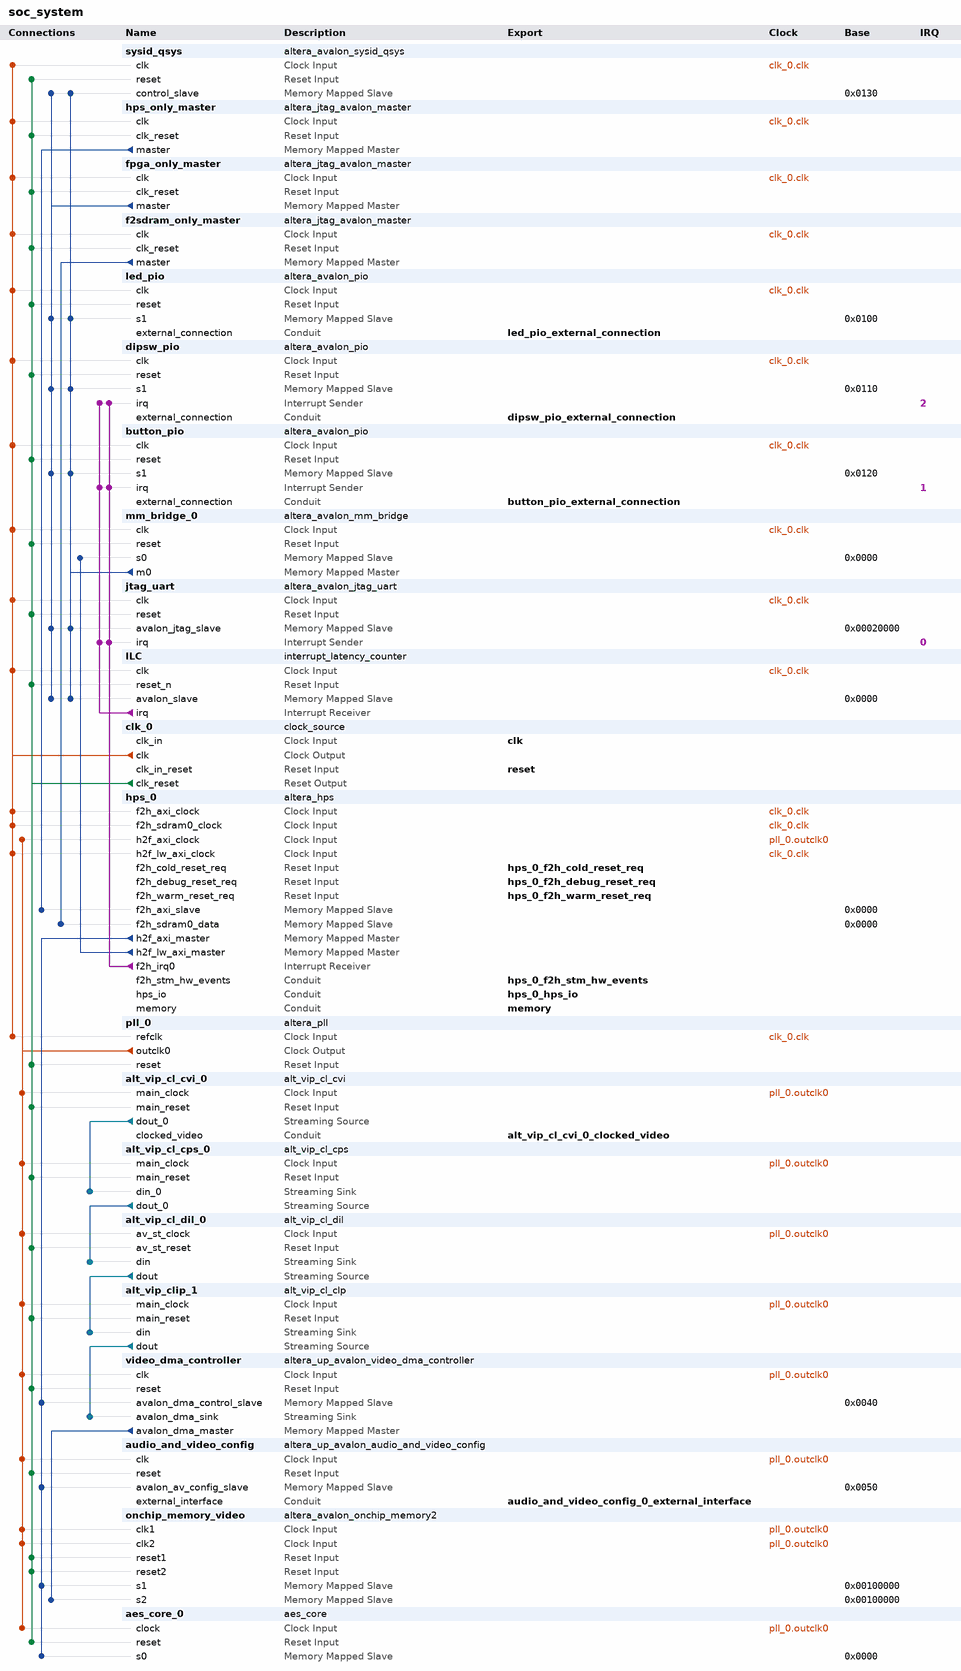
[diagram p0: system contents]
# Platform Designer (Qsys) system soc_system, Cyclone V 5CSXFC6D6F31C6
# Parameters at their usual value, and those the tool derives, are not listed.
package require -exact qsys 18.1
create_system soc_system
set_project_property DEVICE_FAMILY {Cyclone V}
set_project_property DEVICE 5CSXFC6D6F31C6

add_instance sysid_qsys altera_avalon_sysid_qsys 18.1
set_instance_parameter_value sysid_qsys id -1395322110

add_instance hps_only_master altera_jtag_avalon_master 18.1

add_instance fpga_only_master altera_jtag_avalon_master 18.1

add_instance f2sdram_only_master altera_jtag_avalon_master 18.1

add_instance led_pio altera_avalon_pio 18.1
set_instance_parameter_value led_pio direction Output
set_instance_parameter_value led_pio width 10

add_instance dipsw_pio altera_avalon_pio 18.1
set_instance_parameter_value dipsw_pio bitClearingEdgeCapReg true
set_instance_parameter_value dipsw_pio captureEdge true
set_instance_parameter_value dipsw_pio direction Input
set_instance_parameter_value dipsw_pio edgeType ANY
set_instance_parameter_value dipsw_pio generateIRQ true
set_instance_parameter_value dipsw_pio irqType EDGE
set_instance_parameter_value dipsw_pio width 10

add_instance button_pio altera_avalon_pio 18.1
set_instance_parameter_value button_pio bitClearingEdgeCapReg true
set_instance_parameter_value button_pio captureEdge true
set_instance_parameter_value button_pio direction Input
set_instance_parameter_value button_pio edgeType FALLING
set_instance_parameter_value button_pio generateIRQ true
set_instance_parameter_value button_pio irqType EDGE
set_instance_parameter_value button_pio width 4

add_instance mm_bridge_0 altera_avalon_mm_bridge 18.1
set_instance_parameter_value mm_bridge_0 ADDRESS_UNITS SYMBOLS
set_instance_parameter_value mm_bridge_0 ADDRESS_WIDTH 10
set_instance_parameter_value mm_bridge_0 DATA_WIDTH 32
set_instance_parameter_value mm_bridge_0 MAX_PENDING_RESPONSES 4
set_instance_parameter_value mm_bridge_0 USE_AUTO_ADDRESS_WIDTH 1

add_instance jtag_uart altera_avalon_jtag_uart 18.1
set_instance_parameter_value jtag_uart allowMultipleConnections true
set_instance_parameter_value jtag_uart simInteractiveOptions INTERACTIVE_ASCII_OUTPUT

add_instance ILC interrupt_latency_counter 18.1

add_instance clk_0 clock_source 18.1
set_instance_parameter_value clk_0 clockFrequency 50000000

add_instance hps_0 altera_hps 18.1
set_instance_parameter_value hps_0 EMAC1_Mode RGMII
set_instance_parameter_value hps_0 EMAC1_PinMuxing {HPS I/O Set 0}
set_instance_parameter_value hps_0 F2SCLK_COLDRST_Enable true
set_instance_parameter_value hps_0 F2SCLK_DBGRST_Enable true
set_instance_parameter_value hps_0 F2SCLK_WARMRST_Enable true
set_instance_parameter_value hps_0 F2SDRAM_Type {Avalon-MM Bidirectional}
set_instance_parameter_value hps_0 F2SDRAM_Width 256
set_instance_parameter_value hps_0 F2SINTERRUPT_Enable true
set_instance_parameter_value hps_0 F2S_Width 1
set_instance_parameter_value hps_0 FPGA_PERIPHERAL_OUTPUT_CLOCK_FREQ_EMAC0_GTX_CLK 100
set_instance_parameter_value hps_0 FPGA_PERIPHERAL_OUTPUT_CLOCK_FREQ_EMAC0_MD_CLK 100.0
set_instance_parameter_value hps_0 FPGA_PERIPHERAL_OUTPUT_CLOCK_FREQ_EMAC1_GTX_CLK 100
set_instance_parameter_value hps_0 FPGA_PERIPHERAL_OUTPUT_CLOCK_FREQ_EMAC1_MD_CLK 100.0
set_instance_parameter_value hps_0 HPS_PROTOCOL DDR3
set_instance_parameter_value hps_0 I2C0_Mode I2C
set_instance_parameter_value hps_0 I2C0_PinMuxing {HPS I/O Set 0}
set_instance_parameter_value hps_0 I2C1_Mode I2C
set_instance_parameter_value hps_0 I2C1_PinMuxing {HPS I/O Set 0}
set_instance_parameter_value hps_0 LWH2F_Enable true
set_instance_parameter_value hps_0 MEM_BANKADDR_WIDTH 3
set_instance_parameter_value hps_0 MEM_CLK_FREQ 400.0
set_instance_parameter_value hps_0 MEM_COL_ADDR_WIDTH 10
set_instance_parameter_value hps_0 MEM_DQ_WIDTH 32
set_instance_parameter_value hps_0 MEM_DRV_STR RZQ/6
set_instance_parameter_value hps_0 MEM_ROW_ADDR_WIDTH 15
set_instance_parameter_value hps_0 MEM_RTT_NOM RZQ/6
set_instance_parameter_value hps_0 MEM_RTT_WR {Dynamic ODT off}
set_instance_parameter_value hps_0 MEM_TCL 11
set_instance_parameter_value hps_0 MEM_TFAW_NS 45.0
set_instance_parameter_value hps_0 MEM_TRAS_NS 35.0
set_instance_parameter_value hps_0 MEM_TRCD_NS 13.75
set_instance_parameter_value hps_0 MEM_TRFC_NS 260.0
set_instance_parameter_value hps_0 MEM_TRP_NS 13.75
set_instance_parameter_value hps_0 MEM_VENDOR Micron
set_instance_parameter_value hps_0 MEM_WTCL 7
set_instance_parameter_value hps_0 QSPI_Mode {1 SS}
set_instance_parameter_value hps_0 QSPI_PinMuxing {HPS I/O Set 0}
set_instance_parameter_value hps_0 REF_CLK_FREQ 25.0
set_instance_parameter_value hps_0 S2FCLK_USER2CLK 5
set_instance_parameter_value hps_0 S2F_Width 3
set_instance_parameter_value hps_0 SDIO_Mode {4-bit Data}
set_instance_parameter_value hps_0 SDIO_PinMuxing {HPS I/O Set 0}
set_instance_parameter_value hps_0 SPIM0_Mode {Single Slave Select}
set_instance_parameter_value hps_0 SPIM0_PinMuxing {HPS I/O Set 0}
set_instance_parameter_value hps_0 SPIM1_Mode {Single Slave Select}
set_instance_parameter_value hps_0 SPIM1_PinMuxing {HPS I/O Set 0}
set_instance_parameter_value hps_0 STM_Enable true
set_instance_parameter_value hps_0 TIMING_BOARD_AC_SKEW 0.02
set_instance_parameter_value hps_0 TIMING_BOARD_AC_TO_CK_SKEW 0.01
set_instance_parameter_value hps_0 TIMING_BOARD_DQ_TO_DQS_SKEW 0.05
set_instance_parameter_value hps_0 TIMING_BOARD_MAX_CK_DELAY 0.03
set_instance_parameter_value hps_0 TIMING_BOARD_MAX_DQS_DELAY 0.02
set_instance_parameter_value hps_0 TIMING_BOARD_SKEW_BETWEEN_DQS 0.06
set_instance_parameter_value hps_0 TIMING_BOARD_SKEW_CKDQS_DIMM_MAX 0.12
set_instance_parameter_value hps_0 TIMING_BOARD_SKEW_CKDQS_DIMM_MIN 0.06
set_instance_parameter_value hps_0 TIMING_BOARD_SKEW_WITHIN_DQS 0.01
set_instance_parameter_value hps_0 TIMING_TDH 65
set_instance_parameter_value hps_0 TIMING_TDQSCK 255
set_instance_parameter_value hps_0 TIMING_TDQSQ 125
set_instance_parameter_value hps_0 TIMING_TDS 30
set_instance_parameter_value hps_0 TIMING_TIH 140
set_instance_parameter_value hps_0 TIMING_TIS 190
set_instance_parameter_value hps_0 TIMING_TQSH 0.4
set_instance_parameter_value hps_0 UART0_Mode {No Flow Control}
set_instance_parameter_value hps_0 UART0_PinMuxing {HPS I/O Set 0}
set_instance_parameter_value hps_0 USB1_Mode SDR
set_instance_parameter_value hps_0 USB1_PinMuxing {HPS I/O Set 0}
set_instance_parameter_value hps_0 desired_cfg_clk_mhz 100.0
set_instance_parameter_value hps_0 desired_qspi_clk_mhz 400.0

add_instance pll_0 altera_pll 18.1
set_instance_parameter_value pll_0 gui_device_speed_grade 1
set_instance_parameter_value pll_0 gui_number_of_clocks 1
set_instance_parameter_value pll_0 gui_operation_mode direct
set_instance_parameter_value pll_0 gui_output_clock_frequency0 100.0
set_instance_parameter_value pll_0 gui_pll_mode {Integer-N PLL}
set_instance_parameter_value pll_0 gui_reference_clock_frequency 50.0
set_instance_parameter_value pll_0 gui_use_locked true

add_instance alt_vip_cl_cvi_0 alt_vip_cl_cvi 18.1
set_instance_parameter_value alt_vip_cl_cvi_0 ACCEPT_COLOURS_IN_SEQ 0
set_instance_parameter_value alt_vip_cl_cvi_0 ANC_DEPTH 1
set_instance_parameter_value alt_vip_cl_cvi_0 BPS 8
set_instance_parameter_value alt_vip_cl_cvi_0 CLOCKS_ARE_SAME 0
set_instance_parameter_value alt_vip_cl_cvi_0 COLOUR_PLANES_ARE_IN_PARALLEL 0
set_instance_parameter_value alt_vip_cl_cvi_0 EXTRACT_TOTAL_RESOLUTION 1
set_instance_parameter_value alt_vip_cl_cvi_0 FIFO_DEPTH 2048
set_instance_parameter_value alt_vip_cl_cvi_0 GENERATE_ANC 0
set_instance_parameter_value alt_vip_cl_cvi_0 GENERATE_VID_F 0
set_instance_parameter_value alt_vip_cl_cvi_0 H_ACTIVE_PIXELS_F0 720
set_instance_parameter_value alt_vip_cl_cvi_0 INTERLACED 1
set_instance_parameter_value alt_vip_cl_cvi_0 MATCH_CTRLDATA_PKT_CLIP_BASIC 0
set_instance_parameter_value alt_vip_cl_cvi_0 MATCH_CTRLDATA_PKT_PAD_ADV 0
set_instance_parameter_value alt_vip_cl_cvi_0 NO_OF_CHANNELS 1
set_instance_parameter_value alt_vip_cl_cvi_0 NUMBER_OF_COLOUR_PLANES 2
set_instance_parameter_value alt_vip_cl_cvi_0 OVERFLOW_HANDLING 0
set_instance_parameter_value alt_vip_cl_cvi_0 PIXELS_IN_PARALLEL 1
set_instance_parameter_value alt_vip_cl_cvi_0 STD_WIDTH 1
set_instance_parameter_value alt_vip_cl_cvi_0 SYNC_TO 0
set_instance_parameter_value alt_vip_cl_cvi_0 USE_CONTROL 0
set_instance_parameter_value alt_vip_cl_cvi_0 USE_EMBEDDED_SYNCS 1
set_instance_parameter_value alt_vip_cl_cvi_0 USE_HDMI_DEPRICATION 0
set_instance_parameter_value alt_vip_cl_cvi_0 USE_STD 0
set_instance_parameter_value alt_vip_cl_cvi_0 V_ACTIVE_LINES_F0 288
set_instance_parameter_value alt_vip_cl_cvi_0 V_ACTIVE_LINES_F1 288

add_instance alt_vip_cl_cps_0 alt_vip_cl_cps 18.1
set_instance_parameter_value alt_vip_cl_cps_0 BITS_PER_SYMBOL 8
set_instance_parameter_value alt_vip_cl_cps_0 EXTRA_PIPELINING 0
set_instance_parameter_value alt_vip_cl_cps_0 INPUT_0_COLOR_PLANES_ARE_IN_PARALLEL 0
set_instance_parameter_value alt_vip_cl_cps_0 INPUT_0_FIFO 0
set_instance_parameter_value alt_vip_cl_cps_0 INPUT_0_FIFO_SIZE 128
set_instance_parameter_value alt_vip_cl_cps_0 INPUT_0_NUMBER_OF_COLOR_PLANES 2
set_instance_parameter_value alt_vip_cl_cps_0 INPUT_0_PATTERN C,Y
set_instance_parameter_value alt_vip_cl_cps_0 INPUT_0_PIXELS_IN_PARALLEL 1
set_instance_parameter_value alt_vip_cl_cps_0 INPUT_0_TWO_PIXELS_PATTERN 0
set_instance_parameter_value alt_vip_cl_cps_0 INPUT_1_COLOR_PLANES_ARE_IN_PARALLEL 1
set_instance_parameter_value alt_vip_cl_cps_0 INPUT_1_FIFO 0
set_instance_parameter_value alt_vip_cl_cps_0 INPUT_1_FIFO_SIZE 8
set_instance_parameter_value alt_vip_cl_cps_0 INPUT_1_NUMBER_OF_COLOR_PLANES 3
set_instance_parameter_value alt_vip_cl_cps_0 INPUT_1_PATTERN C0,C1,C2
set_instance_parameter_value alt_vip_cl_cps_0 INPUT_1_PIXELS_IN_PARALLEL 1
set_instance_parameter_value alt_vip_cl_cps_0 INPUT_1_TWO_PIXELS_PATTERN 0
set_instance_parameter_value alt_vip_cl_cps_0 INPUT_VALIDATION 1
set_instance_parameter_value alt_vip_cl_cps_0 NUMBER_OF_INPUTS 1
set_instance_parameter_value alt_vip_cl_cps_0 NUMBER_OF_OUTPUTS 1
set_instance_parameter_value alt_vip_cl_cps_0 OUTPUT_0_COLOR_PLANES_ARE_IN_PARALLEL 1
set_instance_parameter_value alt_vip_cl_cps_0 OUTPUT_0_FIFO 0
set_instance_parameter_value alt_vip_cl_cps_0 OUTPUT_0_FIFO_SIZE 128
set_instance_parameter_value alt_vip_cl_cps_0 OUTPUT_0_NUMBER_OF_COLOR_PLANES 2
set_instance_parameter_value alt_vip_cl_cps_0 OUTPUT_0_PATTERN C,Y
set_instance_parameter_value alt_vip_cl_cps_0 OUTPUT_0_PIXELS_IN_PARALLEL 1
set_instance_parameter_value alt_vip_cl_cps_0 OUTPUT_0_TWO_PIXELS_PATTERN 0
set_instance_parameter_value alt_vip_cl_cps_0 OUTPUT_1_COLOR_PLANES_ARE_IN_PARALLEL 1
set_instance_parameter_value alt_vip_cl_cps_0 OUTPUT_1_FIFO 0
set_instance_parameter_value alt_vip_cl_cps_0 OUTPUT_1_FIFO_SIZE 8
set_instance_parameter_value alt_vip_cl_cps_0 OUTPUT_1_NUMBER_OF_COLOR_PLANES 3
set_instance_parameter_value alt_vip_cl_cps_0 OUTPUT_1_PATTERN C0,C1,C2
set_instance_parameter_value alt_vip_cl_cps_0 OUTPUT_1_PIXELS_IN_PARALLEL 1
set_instance_parameter_value alt_vip_cl_cps_0 OUTPUT_1_TWO_PIXELS_PATTERN 0
set_instance_parameter_value alt_vip_cl_cps_0 OUTPUT_VALIDATION 1
set_instance_parameter_value alt_vip_cl_cps_0 USER_PACKET_SUPPORT PASSTHROUGH
set_instance_parameter_value alt_vip_cl_cps_0 USER_PKT_0_TO_0 0
set_instance_parameter_value alt_vip_cl_cps_0 USER_PKT_0_TO_1 0
set_instance_parameter_value alt_vip_cl_cps_0 USER_PKT_1_TO_0 0
set_instance_parameter_value alt_vip_cl_cps_0 USER_PKT_1_TO_1 1

add_instance alt_vip_cl_dil_0 alt_vip_cl_dil 18.1
set_instance_parameter_value alt_vip_cl_dil_0 BITS_PER_SYMBOL 8
set_instance_parameter_value alt_vip_cl_dil_0 BOB_BEHAVIOUR FRAME_FOR_FIELD
set_instance_parameter_value alt_vip_cl_dil_0 CADENCE_ALGORITHM_NAME CADENCE_32_22_VOF
set_instance_parameter_value alt_vip_cl_dil_0 CADENCE_DETECTION 0
set_instance_parameter_value alt_vip_cl_dil_0 CLOCKS_ARE_SEPARATE 0
set_instance_parameter_value alt_vip_cl_dil_0 COLOR_PLANES_ARE_IN_PARALLEL 1
set_instance_parameter_value alt_vip_cl_dil_0 DEINTERLACE_ALGORITHM BOB
set_instance_parameter_value alt_vip_cl_dil_0 DISABLE_EMBEDDED_STREAM_CLEANER 0
set_instance_parameter_value alt_vip_cl_dil_0 EDI_READ_MASTER_BURST_TARGET 32
set_instance_parameter_value alt_vip_cl_dil_0 EDI_READ_MASTER_FIFO_DEPTH 64
set_instance_parameter_value alt_vip_cl_dil_0 FAMILY {Cyclone V}
set_instance_parameter_value alt_vip_cl_dil_0 FIELD_LATENCY 0
set_instance_parameter_value alt_vip_cl_dil_0 INCOMING_VIDEO_IS_422 1
set_instance_parameter_value alt_vip_cl_dil_0 INCOMING_VIDEO_IS_YCBCR 1
set_instance_parameter_value alt_vip_cl_dil_0 MAX_HEIGHT 576
set_instance_parameter_value alt_vip_cl_dil_0 MAX_SYMBOLS_PER_PACKET 10
set_instance_parameter_value alt_vip_cl_dil_0 MAX_WIDTH 720
set_instance_parameter_value alt_vip_cl_dil_0 MA_READ_MASTER_BURST_TARGET 32
set_instance_parameter_value alt_vip_cl_dil_0 MA_READ_MASTER_FIFO_DEPTH 64
set_instance_parameter_value alt_vip_cl_dil_0 MEM_BASE_ADDR 0
set_instance_parameter_value alt_vip_cl_dil_0 MEM_PORT_WIDTH 256
set_instance_parameter_value alt_vip_cl_dil_0 MOTION_BLEED 1
set_instance_parameter_value alt_vip_cl_dil_0 MOTION_BPS 7
set_instance_parameter_value alt_vip_cl_dil_0 MOTION_READ_MASTER_BURST_TARGET 32
set_instance_parameter_value alt_vip_cl_dil_0 MOTION_READ_MASTER_FIFO_DEPTH 64
set_instance_parameter_value alt_vip_cl_dil_0 MOTION_WRITE_MASTER_BURST_TARGET 32
set_instance_parameter_value alt_vip_cl_dil_0 MOTION_WRITE_MASTER_FIFO_DEPTH 64
set_instance_parameter_value alt_vip_cl_dil_0 NUMBER_OF_COLOR_PLANES 2
set_instance_parameter_value alt_vip_cl_dil_0 PIXELS_IN_PARALLEL 1
set_instance_parameter_value alt_vip_cl_dil_0 RUNTIME_CONTROL 0
set_instance_parameter_value alt_vip_cl_dil_0 SWAP_F0_F1 0
set_instance_parameter_value alt_vip_cl_dil_0 USER_PACKETS_MAX_STORAGE 0
set_instance_parameter_value alt_vip_cl_dil_0 USER_PACKET_FIFO_DEPTH 0
set_instance_parameter_value alt_vip_cl_dil_0 USER_PACKET_SUPPORT PASSTHROUGH
set_instance_parameter_value alt_vip_cl_dil_0 WRITE_MASTER_BURST_TARGET 32
set_instance_parameter_value alt_vip_cl_dil_0 WRITE_MASTER_FIFO_DEPTH 64

add_instance alt_vip_clip_1 alt_vip_cl_clp 18.1
set_instance_parameter_value alt_vip_clip_1 BITS_PER_SYMBOL 8
set_instance_parameter_value alt_vip_clip_1 BOTTOM_OFFSET 0
set_instance_parameter_value alt_vip_clip_1 CLIPPING_METHOD RECTANGLE
set_instance_parameter_value alt_vip_clip_1 COLOR_PLANES_ARE_IN_PARALLEL 1
set_instance_parameter_value alt_vip_clip_1 EXTRA_PIPELINING 0
set_instance_parameter_value alt_vip_clip_1 FAMILY {Cyclone V}
set_instance_parameter_value alt_vip_clip_1 LEFT_OFFSET 0
set_instance_parameter_value alt_vip_clip_1 LIMITED_READBACK 0
set_instance_parameter_value alt_vip_clip_1 MAX_IN_HEIGHT 576
set_instance_parameter_value alt_vip_clip_1 MAX_IN_WIDTH 720
set_instance_parameter_value alt_vip_clip_1 NUMBER_OF_COLOR_PLANES 2
set_instance_parameter_value alt_vip_clip_1 PIXELS_IN_PARALLEL 1
set_instance_parameter_value alt_vip_clip_1 RECTANGLE_HEIGHT 360
set_instance_parameter_value alt_vip_clip_1 RECTANGLE_WIDTH 640
set_instance_parameter_value alt_vip_clip_1 RIGHT_OFFSET 0
set_instance_parameter_value alt_vip_clip_1 RUNTIME_CONTROL 0
set_instance_parameter_value alt_vip_clip_1 TOP_OFFSET 24
set_instance_parameter_value alt_vip_clip_1 USER_PACKET_FIFO_DEPTH 0
set_instance_parameter_value alt_vip_clip_1 USER_PACKET_SUPPORT PASSTHROUGH

add_instance video_dma_controller altera_up_avalon_video_dma_controller 18.0
set_instance_parameter_value video_dma_controller addr_mode Consecutive
set_instance_parameter_value video_dma_controller back_start_address 0
set_instance_parameter_value video_dma_controller color_bits 8
set_instance_parameter_value video_dma_controller color_planes 2
set_instance_parameter_value video_dma_controller dma_enabled true
set_instance_parameter_value video_dma_controller height 360
set_instance_parameter_value video_dma_controller mode {From Stream to Memory}
set_instance_parameter_value video_dma_controller start_address 0
set_instance_parameter_value video_dma_controller width 640

add_instance audio_and_video_config altera_up_avalon_audio_and_video_config 18.0
set_instance_parameter_value audio_and_video_config audio_in {Microphone to ADC}
set_instance_parameter_value audio_and_video_config bit_length 24
set_instance_parameter_value audio_and_video_config board DE10-Standard
set_instance_parameter_value audio_and_video_config line_in_bypass false
set_instance_parameter_value audio_and_video_config sampling_rate {48 kHz}
set_instance_parameter_value audio_and_video_config video_format PAL

add_instance onchip_memory_video altera_avalon_onchip_memory2 18.1
set_instance_parameter_value onchip_memory_video dataWidth 1024
set_instance_parameter_value onchip_memory_video dualPort true
set_instance_parameter_value onchip_memory_video initMemContent true
set_instance_parameter_value onchip_memory_video initializationFileName onchip_mem.hex
set_instance_parameter_value onchip_memory_video memorySize 460802

add_instance aes_core_0 aes_core 1.0

# connections
add_connection clk_0.clk button_pio.clk clock
add_connection clk_0.clk dipsw_pio.clk clock
add_connection clk_0.clk f2sdram_only_master.clk clock
add_connection clk_0.clk fpga_only_master.clk clock
add_connection clk_0.clk hps_0.f2h_axi_clock clock
add_connection clk_0.clk hps_0.f2h_sdram0_clock clock
add_connection clk_0.clk hps_0.h2f_lw_axi_clock clock
add_connection clk_0.clk hps_only_master.clk clock
add_connection clk_0.clk ILC.clk clock
add_connection clk_0.clk jtag_uart.clk clock
add_connection clk_0.clk led_pio.clk clock
add_connection clk_0.clk mm_bridge_0.clk clock
add_connection clk_0.clk pll_0.refclk clock
add_connection clk_0.clk sysid_qsys.clk clock
add_connection pll_0.outclk0 aes_core_0.clock clock
add_connection pll_0.outclk0 alt_vip_cl_cps_0.main_clock clock
add_connection pll_0.outclk0 alt_vip_cl_cvi_0.main_clock clock
add_connection pll_0.outclk0 alt_vip_cl_dil_0.av_st_clock clock
add_connection pll_0.outclk0 alt_vip_clip_1.main_clock clock
add_connection pll_0.outclk0 audio_and_video_config.clk clock
add_connection pll_0.outclk0 hps_0.h2f_axi_clock clock
add_connection pll_0.outclk0 onchip_memory_video.clk1 clock
add_connection pll_0.outclk0 onchip_memory_video.clk2 clock
add_connection pll_0.outclk0 video_dma_controller.clk clock
add_connection clk_0.clk_reset aes_core_0.reset reset
add_connection clk_0.clk_reset alt_vip_cl_cps_0.main_reset reset
add_connection clk_0.clk_reset alt_vip_cl_cvi_0.main_reset reset
add_connection clk_0.clk_reset alt_vip_cl_dil_0.av_st_reset reset
add_connection clk_0.clk_reset alt_vip_clip_1.main_reset reset
add_connection clk_0.clk_reset audio_and_video_config.reset reset
add_connection clk_0.clk_reset button_pio.reset reset
add_connection clk_0.clk_reset dipsw_pio.reset reset
add_connection clk_0.clk_reset f2sdram_only_master.clk_reset reset
add_connection clk_0.clk_reset fpga_only_master.clk_reset reset
add_connection clk_0.clk_reset hps_only_master.clk_reset reset
add_connection clk_0.clk_reset ILC.reset_n reset
add_connection clk_0.clk_reset jtag_uart.reset reset
add_connection clk_0.clk_reset led_pio.reset reset
add_connection clk_0.clk_reset mm_bridge_0.reset reset
add_connection clk_0.clk_reset onchip_memory_video.reset1 reset
add_connection clk_0.clk_reset onchip_memory_video.reset2 reset
add_connection clk_0.clk_reset pll_0.reset reset
add_connection clk_0.clk_reset sysid_qsys.reset reset
add_connection clk_0.clk_reset video_dma_controller.reset reset
add_connection f2sdram_only_master.master hps_0.f2h_sdram0_data avalon
set_connection_parameter_value f2sdram_only_master.master/hps_0.f2h_sdram0_data baseAddress 0x0000
add_connection fpga_only_master.master button_pio.s1 avalon
set_connection_parameter_value fpga_only_master.master/button_pio.s1 baseAddress 0x0120
add_connection fpga_only_master.master dipsw_pio.s1 avalon
set_connection_parameter_value fpga_only_master.master/dipsw_pio.s1 baseAddress 0x0110
add_connection fpga_only_master.master ILC.avalon_slave avalon
set_connection_parameter_value fpga_only_master.master/ILC.avalon_slave baseAddress 0x0000
add_connection fpga_only_master.master jtag_uart.avalon_jtag_slave avalon
set_connection_parameter_value fpga_only_master.master/jtag_uart.avalon_jtag_slave baseAddress 0x00020000
add_connection fpga_only_master.master led_pio.s1 avalon
set_connection_parameter_value fpga_only_master.master/led_pio.s1 baseAddress 0x0100
add_connection fpga_only_master.master sysid_qsys.control_slave avalon
set_connection_parameter_value fpga_only_master.master/sysid_qsys.control_slave baseAddress 0x0130
add_connection hps_0.h2f_axi_master aes_core_0.s0 avalon
set_connection_parameter_value hps_0.h2f_axi_master/aes_core_0.s0 baseAddress 0x0000
add_connection hps_0.h2f_axi_master audio_and_video_config.avalon_av_config_slave avalon
set_connection_parameter_value hps_0.h2f_axi_master/audio_and_video_config.avalon_av_config_slave baseAddress 0x0050
add_connection hps_0.h2f_axi_master onchip_memory_video.s1 avalon
set_connection_parameter_value hps_0.h2f_axi_master/onchip_memory_video.s1 baseAddress 0x00100000
add_connection hps_0.h2f_axi_master video_dma_controller.avalon_dma_control_slave avalon
set_connection_parameter_value hps_0.h2f_axi_master/video_dma_controller.avalon_dma_control_slave baseAddress 0x0040
add_connection hps_0.h2f_lw_axi_master mm_bridge_0.s0 avalon
set_connection_parameter_value hps_0.h2f_lw_axi_master/mm_bridge_0.s0 baseAddress 0x0000
add_connection hps_only_master.master hps_0.f2h_axi_slave avalon
set_connection_parameter_value hps_only_master.master/hps_0.f2h_axi_slave baseAddress 0x0000
add_connection mm_bridge_0.m0 button_pio.s1 avalon
set_connection_parameter_value mm_bridge_0.m0/button_pio.s1 baseAddress 0x0120
add_connection mm_bridge_0.m0 dipsw_pio.s1 avalon
set_connection_parameter_value mm_bridge_0.m0/dipsw_pio.s1 baseAddress 0x0110
add_connection mm_bridge_0.m0 ILC.avalon_slave avalon
set_connection_parameter_value mm_bridge_0.m0/ILC.avalon_slave baseAddress 0x0000
add_connection mm_bridge_0.m0 jtag_uart.avalon_jtag_slave avalon
set_connection_parameter_value mm_bridge_0.m0/jtag_uart.avalon_jtag_slave baseAddress 0x00020000
add_connection mm_bridge_0.m0 led_pio.s1 avalon
set_connection_parameter_value mm_bridge_0.m0/led_pio.s1 baseAddress 0x0100
add_connection mm_bridge_0.m0 sysid_qsys.control_slave avalon
set_connection_parameter_value mm_bridge_0.m0/sysid_qsys.control_slave baseAddress 0x0130
add_connection video_dma_controller.avalon_dma_master onchip_memory_video.s2 avalon
set_connection_parameter_value video_dma_controller.avalon_dma_master/onchip_memory_video.s2 baseAddress 0x00100000
add_connection alt_vip_cl_cps_0.dout_0 alt_vip_cl_dil_0.din avalon_streaming
add_connection alt_vip_cl_cvi_0.dout_0 alt_vip_cl_cps_0.din_0 avalon_streaming
add_connection alt_vip_cl_dil_0.dout alt_vip_clip_1.din avalon_streaming
add_connection alt_vip_clip_1.dout video_dma_controller.avalon_dma_sink avalon_streaming
add_connection hps_0.f2h_irq0 button_pio.irq interrupt
set_connection_parameter_value hps_0.f2h_irq0/button_pio.irq irqNumber 1
add_connection hps_0.f2h_irq0 dipsw_pio.irq interrupt
set_connection_parameter_value hps_0.f2h_irq0/dipsw_pio.irq irqNumber 2
add_connection hps_0.f2h_irq0 jtag_uart.irq interrupt
set_connection_parameter_value hps_0.f2h_irq0/jtag_uart.irq irqNumber 0
add_connection ILC.irq button_pio.irq interrupt
set_connection_parameter_value ILC.irq/button_pio.irq irqNumber 1
add_connection ILC.irq dipsw_pio.irq interrupt
set_connection_parameter_value ILC.irq/dipsw_pio.irq irqNumber 2
add_connection ILC.irq jtag_uart.irq interrupt
set_connection_parameter_value ILC.irq/jtag_uart.irq irqNumber 0

# exported interfaces
add_interface alt_vip_cl_cvi_0_clocked_video conduit end
set_interface_property alt_vip_cl_cvi_0_clocked_video EXPORT_OF alt_vip_cl_cvi_0.clocked_video
add_interface audio_and_video_config_0_external_interface conduit end
set_interface_property audio_and_video_config_0_external_interface EXPORT_OF audio_and_video_config.external_interface
add_interface button_pio_external_connection conduit end
set_interface_property button_pio_external_connection EXPORT_OF button_pio.external_connection
add_interface clk clock sink
set_interface_property clk EXPORT_OF clk_0.clk_in
add_interface dipsw_pio_external_connection conduit end
set_interface_property dipsw_pio_external_connection EXPORT_OF dipsw_pio.external_connection
add_interface hps_0_f2h_cold_reset_req reset sink
set_interface_property hps_0_f2h_cold_reset_req EXPORT_OF hps_0.f2h_cold_reset_req
add_interface hps_0_f2h_debug_reset_req reset sink
set_interface_property hps_0_f2h_debug_reset_req EXPORT_OF hps_0.f2h_debug_reset_req
add_interface hps_0_f2h_stm_hw_events conduit end
set_interface_property hps_0_f2h_stm_hw_events EXPORT_OF hps_0.f2h_stm_hw_events
add_interface hps_0_f2h_warm_reset_req reset sink
set_interface_property hps_0_f2h_warm_reset_req EXPORT_OF hps_0.f2h_warm_reset_req
add_interface hps_0_hps_io conduit end
set_interface_property hps_0_hps_io EXPORT_OF hps_0.hps_io
add_interface led_pio_external_connection conduit end
set_interface_property led_pio_external_connection EXPORT_OF led_pio.external_connection
add_interface memory conduit end
set_interface_property memory EXPORT_OF hps_0.memory
add_interface reset reset sink
set_interface_property reset EXPORT_OF clk_0.clk_in_reset

set_interconnect_requirement {$system} qsys_mm.clockCrossingAdapter HANDSHAKE
set_interconnect_requirement {$system} qsys_mm.maxAdditionalLatency 1

save_system soc_system.qsys
